# EAGLE board PlaneSimulatorIO (EAGLE 9.6.2)
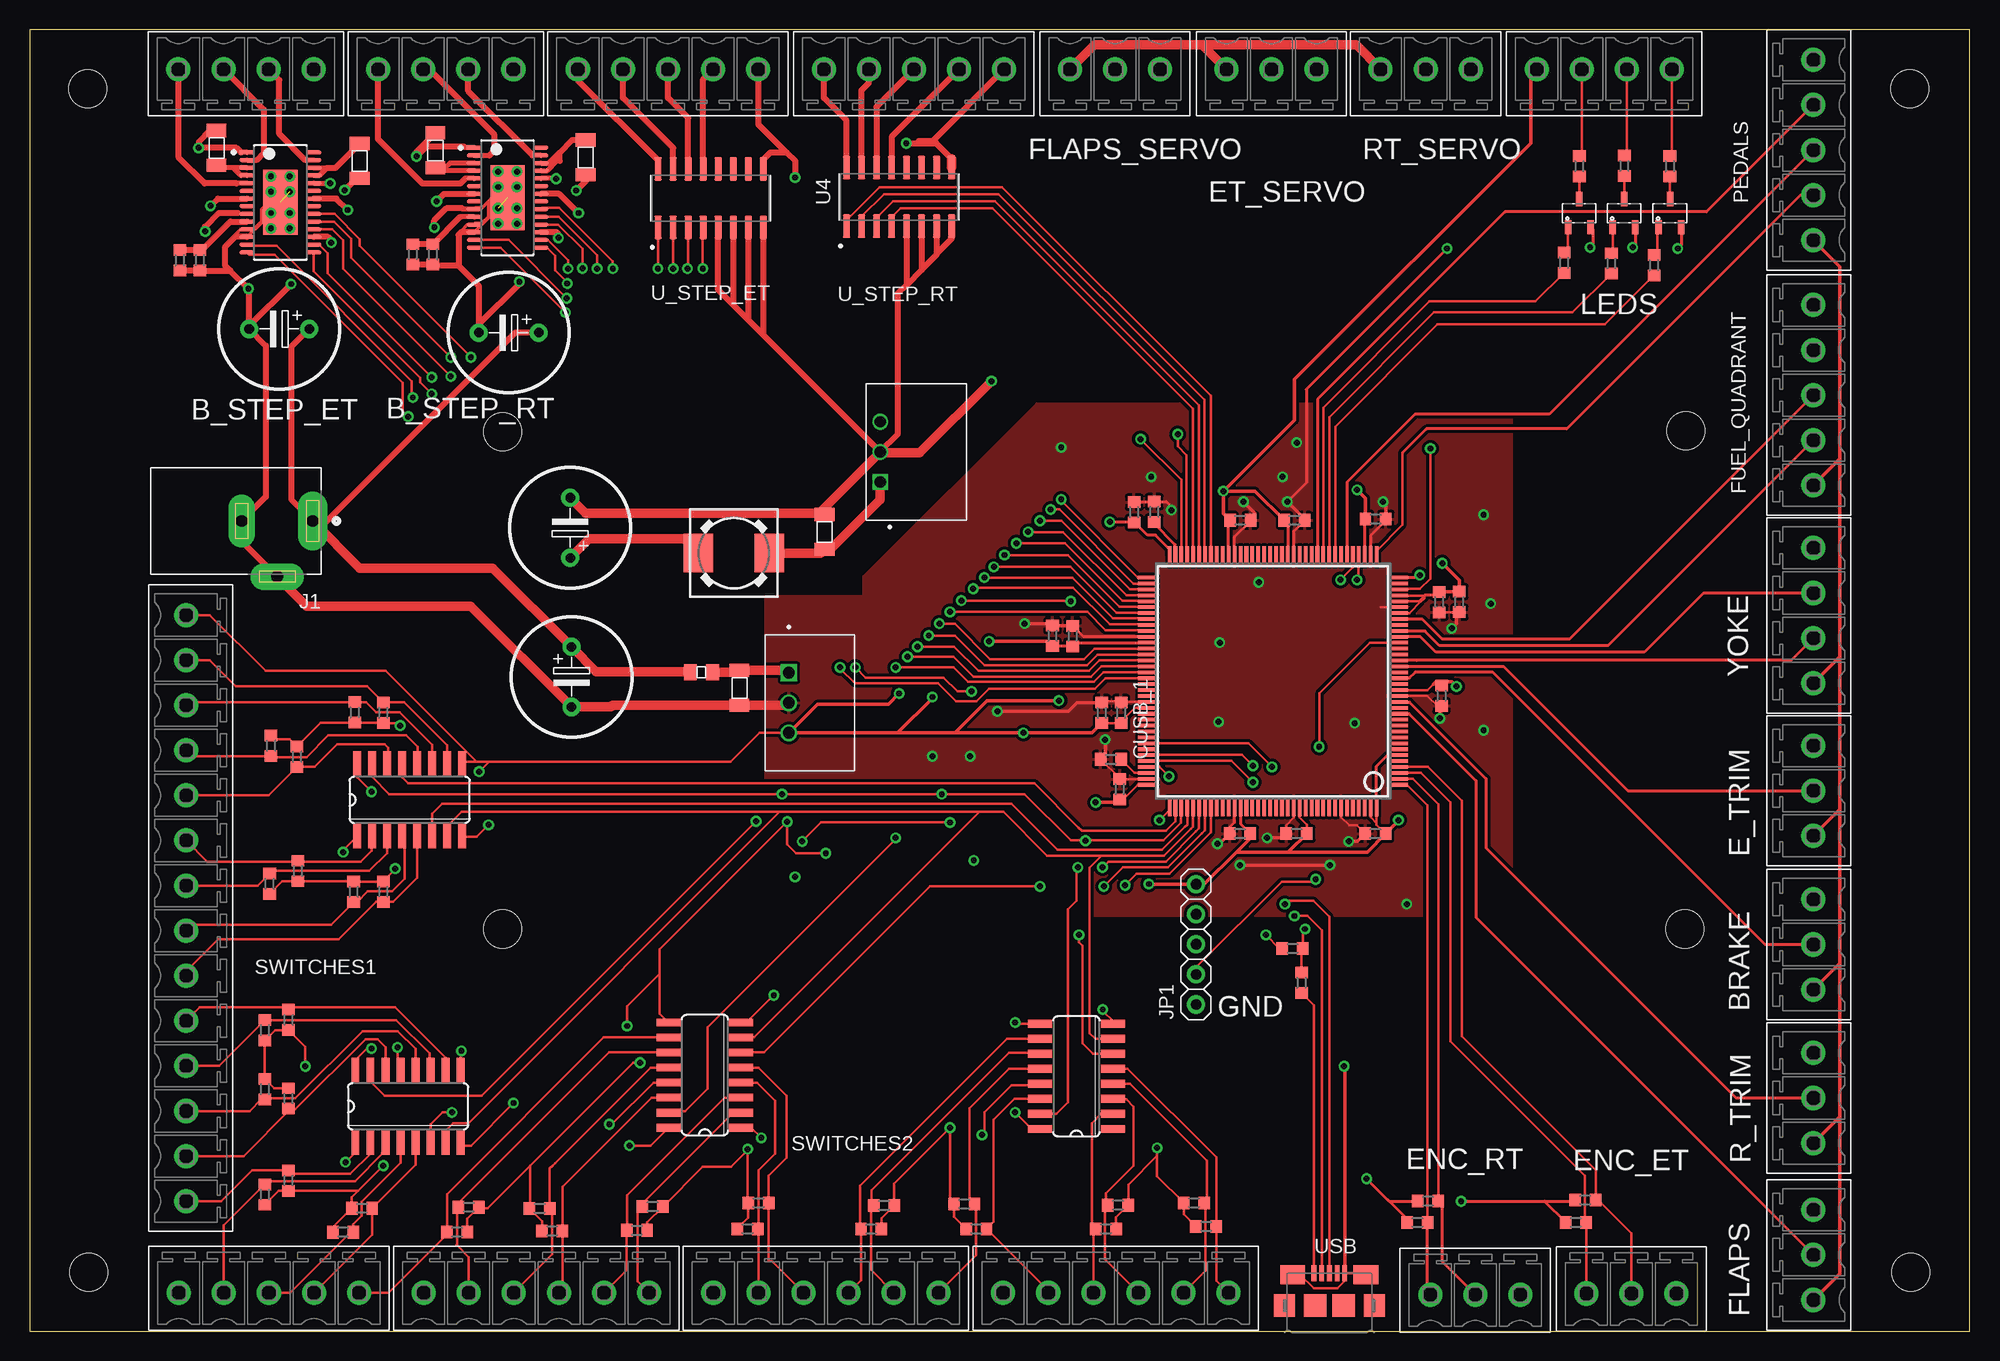
[diagram p5: board, top side]
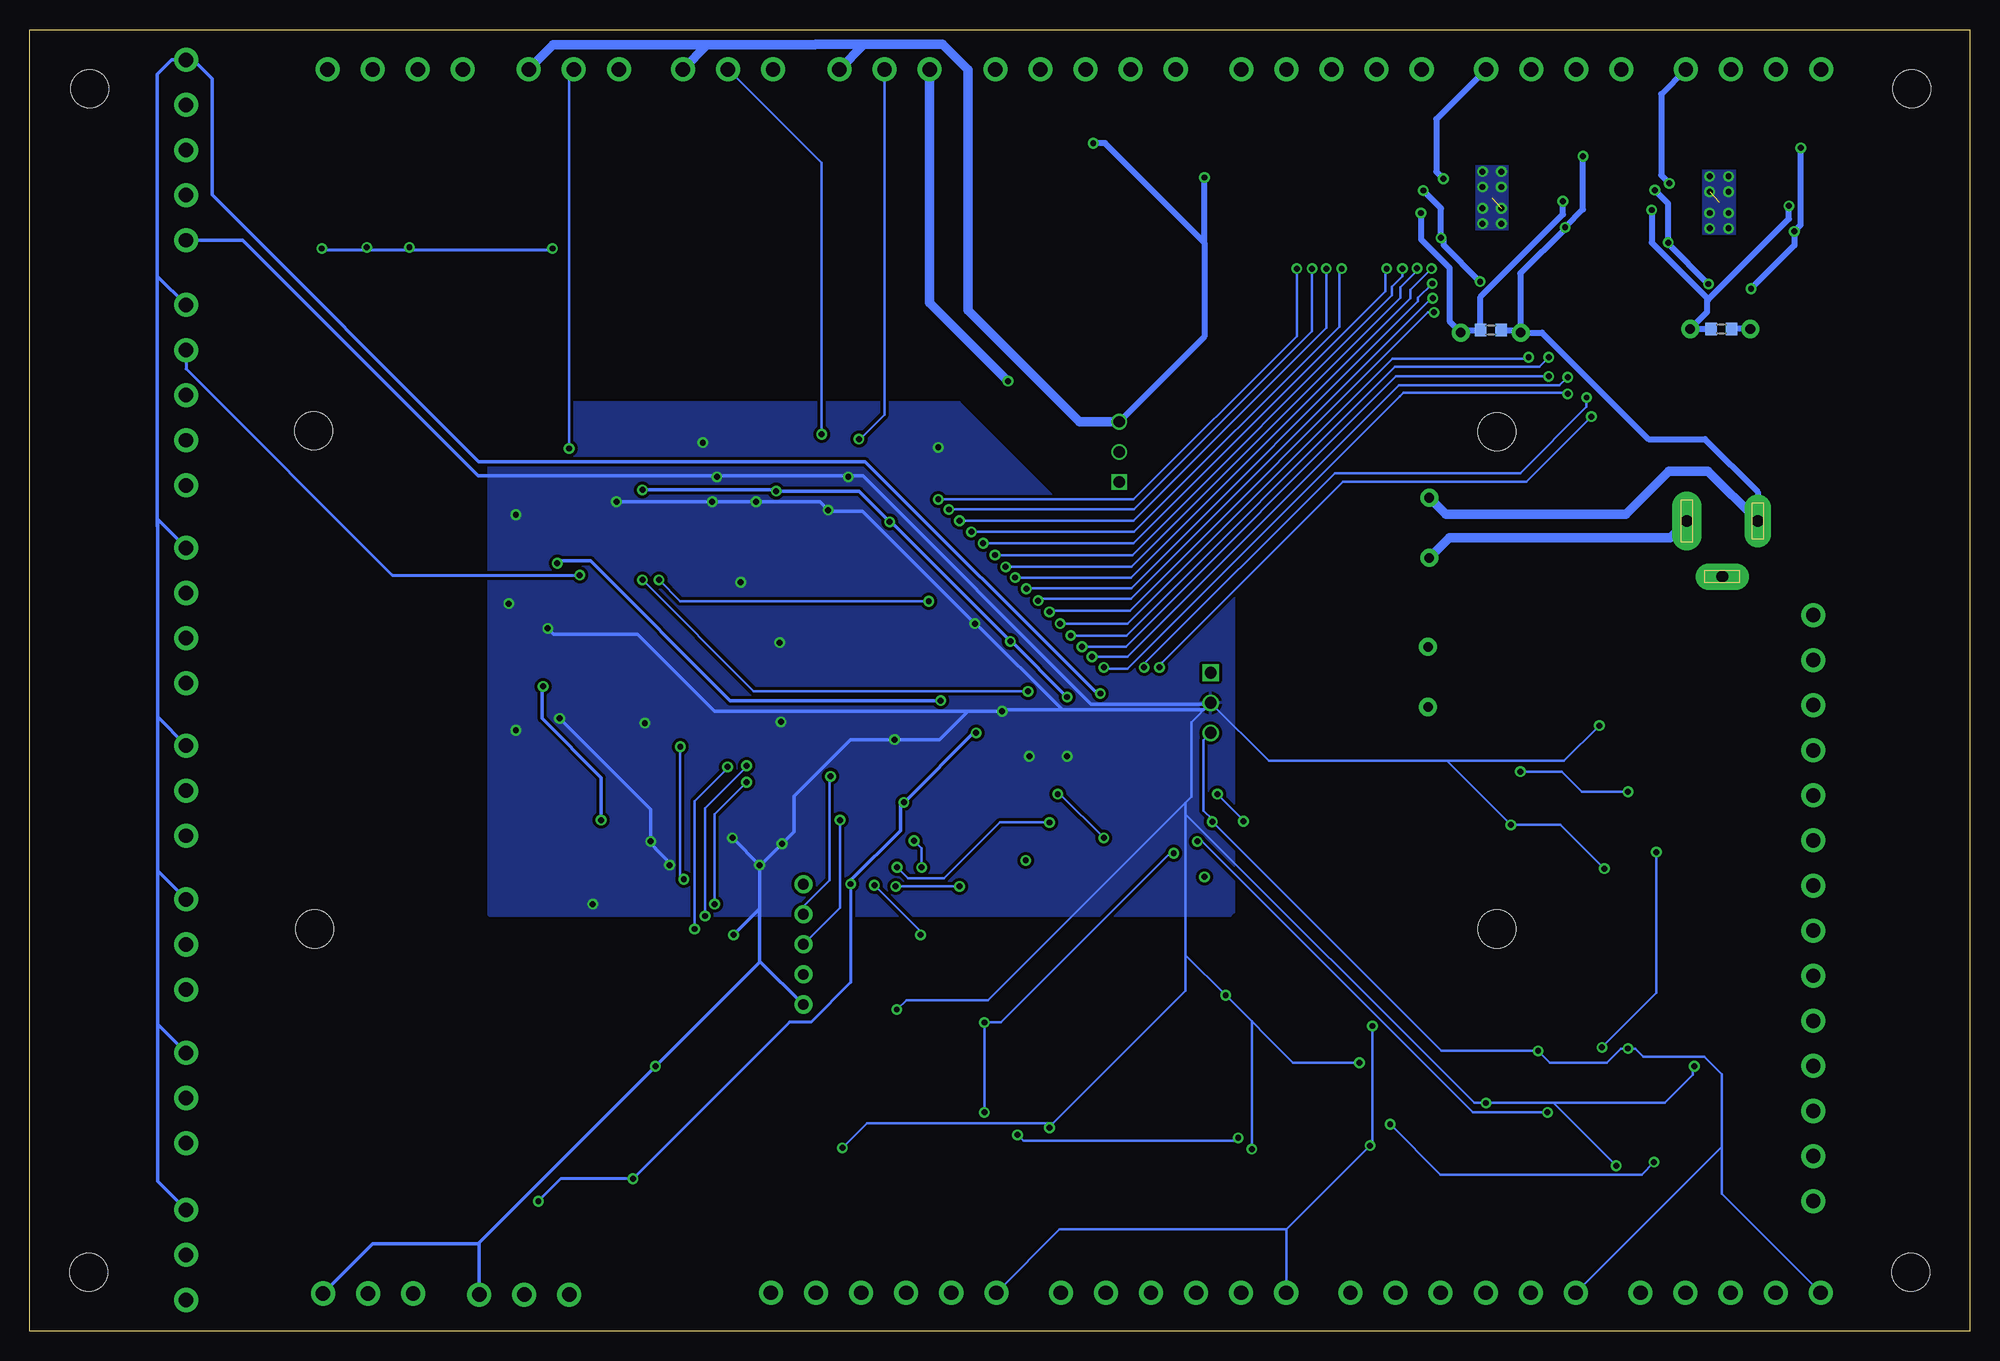
[diagram p6: board, bottom side, seen from below]

Size 164 x 110 mm. Coordinates in mm from the lower left corner, seen from the top.
Outline: 0,0 164,0 164,110 0,110 0,0
Copper layers (1*16): Top 0mil / dielectric 1.5mm / Bottom 0mil
Design rules "trida5b": minimum track width 0.1mm, minimum drill 0.5mm, track to track 0.2mm, track to pad 0.2mm, pad to pad 0.2mm, via to via 0.3mm, smd to smd 0.2mm, copper to edge 0.4mm, drill to drill 0.5mm, minimum pad ring 0.2mm, minimum via ring 0.2mm, stop-mask expansion 0mil, vias tented up to drill 0.5mm, thermal gap 10mil

## Footprints (pad centres in the part's own frame; a part is rotated, then mirrored left to right if it is on the bottom)
1206 = smd 1.118 x 1.676: 1 -1.473,0; 2 1.473,0
EC10-5 = drill 0.813 pad 1.524: 1 -2.54,0; 2 2.54,0
0805 = smd 1.067 x 1.372: 1 -0.94,0; 2 0.94,0
DR74 = smd 2.5 x 3.25: 1 -3,0; 2 3,0
0603 = smd 0.965 x 1.067: 1 -0.864,0; 2 0.864,0
MCV4 = drill 1.219 pad 2.032: 1 0,0; 2 3.81,0; 3 7.62,0; 4 11.43,0
SOT23-3L = smd 0.55 x 1.2: 1 0.95,1.2; 2 -0.95,1.2; 3 0,-1.2
MCV3 = drill 1.219 pad 2.032: 1 0,0; 2 3.81,0; 3 7.62,0
MCV5 = drill 1.219 pad 2.032: 1 0,0; 2 3.81,0; 3 7.62,0; 4 11.43,0; 5 15.24,0
SO16 = smd 0.66 x 2.032: 1 -4.445,-3.073; 2 -3.175,-3.073; 3 -1.905,-3.073; 4 -0.635,-3.073; 5 0.635,-3.073; 6 1.905,-3.073; 7 3.175,-3.073; 8 4.445,-3.073; 9 4.445,3.073; 10 3.175,3.073; 11 1.905,3.073; 12 0.635,3.073; 13 -0.635,3.073; 14 -1.905,3.073; 15 -3.175,3.073; 16 -4.445,3.073
CUI_PJ-002AH = drill 1 pad 2.5 long: 1 0,0 | drill 1 pad 2.25 long: 2 6,0; 3 3,4.7
JP_05 = drill 0.914 pad 1.524: 1 -5.08,0; 2 -2.54,0; 3 0,0; 4 2.54,0; 5 5.08,0
CONV_R-78B5.0-2.0 = drill 0.94 square: 1 -2.54,3.05 | drill 0.94: 2 0,3.05; 3 2.54,3.05
CONV_R-783.3-1.0 = drill 1 square: 1 -2.54,-1.775 | drill 1: 2 0,-1.775; 3 2.54,-1.775
MCV14 = drill 1.219 pad 2.032: 1 0,0; 2 3.81,0; 3 7.62,0; 4 11.43,0; 5 15.24,0; 6 19.05,0; 7 22.86,0; 8 26.67,0; 9 30.48,0; 10 34.29,0; 11 38.1,0; 12 41.91,0; 13 45.72,0; 14 49.53,0
ROHM_BD63715AEFV-E2_3 = smd 1.255 x 0.334: 1 -2.825,4.225; 2 -2.825,3.575; 3 -2.825,2.925; 4 -2.825,2.275; 5 -2.825,1.625; 6 -2.825,0.975; 7 -2.825,0.325; 8 -2.825,-0.325; 9 -2.825,-0.975; 10 -2.825,-1.625; 11 -2.825,-2.275; 12 -2.825,-2.925; 13 -2.825,-3.575; 14 -2.825,-4.225; 15 2.825,-4.225; 16 2.825,-3.575; 17 2.825,-2.925; 18 2.825,-2.275; 19 2.825,-1.625; 20 2.825,-0.975; 21 2.825,-0.325; 23 2.825,0.975; 24 2.825,1.625; 25 2.825,2.275; 26 2.825,2.925; 27 2.825,3.575; 28 2.825,4.225; P$22 2.825,0.325 | smd 2.9 x 5.5: 29 0,0
SOIC127P600X175-16N = smd 1.97 x 0.6: 1 -2.475,4.445; 2 -2.475,3.175; 3 -2.475,1.905; 4 -2.475,0.635; 5 -2.475,-0.635; 6 -2.475,-1.905; 7 -2.475,-3.175; 8 -2.475,-4.445; 9 2.475,-4.445; 10 2.475,-3.175; 11 2.475,-1.905; 12 2.475,-0.635; 13 2.475,0.635; 14 2.475,1.905; 15 2.475,3.175; 16 2.475,4.445
M3-HOLE = hole 3.2: 0,0
SQFP-S-20X20-144 = smd 0.3 x 1.6: 1 -8.75,-10.6; 2 -8.25,-10.6; 3 -7.75,-10.6; 4 -7.25,-10.6; 5 -6.75,-10.6; 6 -6.25,-10.6; 7 -5.75,-10.6; 8 -5.25,-10.6; 9 -4.75,-10.6; 10 -4.25,-10.6; 11 -3.75,-10.6; 12 -3.25,-10.6; 13 -2.75,-10.6; 14 -2.25,-10.6; 15 -1.75,-10.6; 16 -1.25,-10.6; 17 -0.75,-10.6; 18 -0.25,-10.6; 19 0.25,-10.6; 20 0.75,-10.6; 21 1.25,-10.6; 22 1.75,-10.6; 23 2.25,-10.6; 24 2.75,-10.6; 25 3.25,-10.6; 26 3.75,-10.6; 27 4.25,-10.6; 28 4.75,-10.6; 29 5.25,-10.6; 30 5.75,-10.6; 31 6.25,-10.6; 32 6.75,-10.6; 33 7.25,-10.6; 34 7.75,-10.6; 35 8.25,-10.6; 36 8.75,-10.6; 73 8.75,10.6; 74 8.25,10.6; 75 7.75,10.6; 76 7.25,10.6; 77 6.75,10.6; 78 6.25,10.6; 79 5.75,10.6; 80 5.25,10.6; 81 4.75,10.6; 82 4.25,10.6; 83 3.75,10.6; 84 3.25,10.6; 85 2.75,10.6; 86 2.25,10.6; 87 1.75,10.6; 88 1.25,10.6; 89 0.75,10.6; 90 0.25,10.6; 91 -0.25,10.6; 92 -0.75,10.6; 93 -1.25,10.6; 94 -1.75,10.6; 95 -2.25,10.6; 96 -2.75,10.6; 97 -3.25,10.6; 98 -3.75,10.6; 99 -4.25,10.6; 100 -4.75,10.6; 101 -5.25,10.6; 102 -5.75,10.6; 103 -6.25,10.6; 104 -6.75,10.6; 105 -7.25,10.6; 106 -7.75,10.6; 107 -8.25,10.6; 108 -8.75,10.6 | smd 1.6 x 0.3: 37 10.6,-8.75; 38 10.6,-8.25; 39 10.6,-7.75; 40 10.6,-7.25; 41 10.6,-6.75; 42 10.6,-6.25; 43 10.6,-5.75; 44 10.6,-5.25; 45 10.6,-4.75; 46 10.6,-4.25; 47 10.6,-3.75; 48 10.6,-3.25; 49 10.6,-2.75; 50 10.6,-2.25; 51 10.6,-1.75; 52 10.6,-1.25; 53 10.6,-0.75; 54 10.6,-0.25; 55 10.6,0.25; 56 10.6,0.75; 57 10.6,1.25; 58 10.6,1.75; 59 10.6,2.25; 60 10.6,2.75; 61 10.6,3.25; 62 10.6,3.75; 63 10.6,4.25; 64 10.6,4.75; 65 10.6,5.25; 66 10.6,5.75; 67 10.6,6.25; 68 10.6,6.75; 69 10.6,7.25; 70 10.6,7.75; 71 10.6,8.25; 72 10.6,8.75; 109 -10.6,8.75; 110 -10.6,8.25; 111 -10.6,7.75; 112 -10.6,7.25; 113 -10.6,6.75; 114 -10.6,6.25; 115 -10.6,5.75; 116 -10.6,5.25; 117 -10.6,4.75; 118 -10.6,4.25; 119 -10.6,3.75; 120 -10.6,3.25; 121 -10.6,2.75; 122 -10.6,2.25; 123 -10.6,1.75; 124 -10.6,1.25; 125 -10.6,0.75; 126 -10.6,0.25; 127 -10.6,-0.25; 128 -10.6,-0.75; 129 -10.6,-1.25; 130 -10.6,-1.75; 131 -10.6,-2.25; 132 -10.6,-2.75; 133 -10.6,-3.25; 134 -10.6,-3.75; 135 -10.6,-4.25; 136 -10.6,-4.75; 137 -10.6,-5.25; 138 -10.6,-5.75; 139 -10.6,-6.25; 140 -10.6,-6.75; 141 -10.6,-7.25; 142 -10.6,-7.75; 143 -10.6,-8.25; 144 -10.6,-8.75
USB-MICRO-H_10118192-0001LF = smd 0.4 x 1.35: D+ 0,0; D- -0.65,0; GND 1.3,0; ID 0.65,0; VBUS -1.3,0 | smd 2.1 x 1.6: S1 -3.1,-0.125; S2 3.1,-0.125 | smd 1.8 x 1.9: S3 -3.8,-2.7; S6 3.8,-2.7 | smd 1.9 x 1.9: S4 -1.2,-2.7; S5 1.2,-2.7
MCV6 = drill 1.219 pad 2.032: 1 0,0; 2 3.81,0; 3 7.62,0; 4 11.43,0; 5 15.24,0; 6 19.05,0

## Placement (x,y rotation side)
3.3V_C1  2.2u  [1206]  59.99,54.38 90 top
3.3V_C2  10u  [EC10-5]  45.8,55.3 270 top
3.3V_L1  5.6u  [0805]  56.79,55.7 0 top
5V_C1  4.7u  [1206]  67.19,67.56 270 top
5V_C2  10u  [EC10-5]  45.7,67.9 90 top
5V_L1  10u  [DR74]  59.52,65.76 0 top
B1_CT  820p  [0603]  12.7,90.5 90 top
B1_CVS1  100u  [EC10-5]  21.1,84.7 180 top
B1_CVS2  100n  [0603]  21,84.7 180 bottom
B1_RNF1  470m  [1206]  15.8,100 270 top
B1_RNF2  470m  [1206]  27.9,98.9 90 top
B1_RT  56k  [0603]  14.4,90.5 90 top
B2_CT  820p  [0603]  32.4,91 90 top
B2_CVS1  100u  [EC10-5]  40.5,84.4 180 top
B2_CVS2  100n  [0603]  40.5,84.6 180 bottom
B2_RNF1  470m  [1206]  34.3,99.8 270 top
B2_RNF2  470m  [1206]  47,99.2 90 top
B2_RT  56k  [0603]  34.1,91 90 top
B_STEP_ET  [MCV4]  12.58,106.64 0 top
B_STEP_RT  [MCV4]  29.46,106.64 0 top
BFS1_LED2  [SOT23-3L]  134.76,94.49 180 top
BFS2_LED3  [SOT23-3L]  138.64,94.49 180 top
BFS20_LED1  [SOT23-3L]  130.98,94.49 180 top
BRAKE  [MCV3]  150.77,36.5 270 top
C_VCAP  2.2u  [0603]  95.06,69.25 270 top
CDD_17  100n  [0603]  119.34,53.71 90 top
CDD_39  100n  [0603]  113.77,68.64 180 top
CDD_52  100n  [0603]  106.91,68.54 180 top
CDD_62  100n  [0603]  102.33,68.54 180 top
CDD_72  100n  [0603]  93.36,69.21 270 top
CDD_84  100n  [0603]  88.16,58.75 270 top
CDD_84_2  4.7u  [0603]  86.46,58.77 270 top
CDD_108  100n  [0603]  92.14,45.81 270 top
CDD_121  100n  [0603]  102.31,42.06 0 top
CDD_131  100n  [0603]  107.09,42.06 0 top
CDD_144  100n  [0603]  113.75,42.06 0 top
CG_106  2.2u  [0603]  91.39,48.34 0 top
CUSB_1  100n  [0603]  92.26,52.27 270 top
CUSB_2  1u  [0603]  90.63,52.26 270 top
CVDDA_1  1u  [0603]  119.14,61.62 90 top
CVDDA_2  10n  [0603]  120.84,61.64 90 top
E_TRIM  [MCV3]  150.77,49.5 270 top
ENC_ET  [MCV3]  139.2,3.2 180 top
ENC_RT  [MCV3]  126,3.1 180 top
ET_SERVO  [MCV3]  101.16,106.64 0 top
FLAPS  [MCV3]  150.77,10.27 270 top
FLAPS_SERVO  [MCV3]  87.93,106.64 0 top
FUEL_QUADRANT  [MCV5]  150.77,86.73 270 top
IC1  74HC166D  [SO16]  57.08,21.66 90 top
IC2  74HC166D  [SO16]  31.99,19.02 0 top
IC3  74HC166D  [SO16]  32.12,44.92 0 top
IC4  74HC166D  [SO16]  88.48,21.55 90 top
J1  PJ-002AH  [CUI_PJ-002AH]  23.93,68.48 180 top
JP1  [JP_05]  98.6,32.7 90 top
LEDS  [MCV4]  127.38,106.64 0 top
PEDALS  [MCV5]  150.77,107.44 270 top
PS1  R-78B5.0-2.0  [CONV_R-78B5.0-2.0]  74.95,74.31 90 top
PS2  R-783.3-1.0  [CONV_R-783.3-1.0]  65.95,53.11 270 top
R1  10k  [0603]  90.98,8.66 180 top
R2  10k  [0603]  92,10.66 180 top
R3  10k  [0603]  98.42,10.86 0 top
R4  10k  [0603]  99.44,8.86 0 top
R5  10k  [0603]  71.14,8.64 180 top
R6  10k  [0603]  72.22,10.64 180 top
R7  10k  [0603]  79,10.76 0 top
R8  10k  [0603]  80.02,8.66 0 top
R9  10k  [0603]  52.66,10.54 180 top
R10  10k  [0603]  51.33,8.54 180 top
R11  10k  [0603]  60.69,8.66 0 top
R12  10k  [0603]  61.61,10.86 0 top
R13  10k  [0603]  36.14,8.39 180 top
R14  10k  [0603]  37.12,10.49 180 top
R15  10k  [0603]  43.1,10.39 0 top
R16  10k  [0603]  44.18,8.49 0 top
R17  10k  [0603]  21.89,12.74 90 top
R18  10k  [0603]  19.89,11.56 90 top
R19  10k  [0603]  26.49,8.38 0 top
R20  10k  [0603]  28.09,10.4 0 top
R21  10k  [0603]  21.89,26.32 90 top
R22  10k  [0603]  19.89,25.44 90 top
R23  10k  [0603]  19.89,20.46 270 top
R24  10k  [0603]  21.89,19.68 270 top
R25  10k  [0603]  22.69,38.9 90 top
R26  10k  [0603]  20.29,37.82 90 top
R27  10k  [0603]  27.39,37.14 270 top
R28  10k  [0603]  29.89,37.16 270 top
R29  10k  [0603]  29.89,52.28 90 top
R30  10k  [0603]  27.49,52.3 90 top
R31  10k  [0603]  20.41,49.48 270 top
R32  10k  [0603]  22.61,48.56 270 top
R33  10k  [0603]  131.5,11.1 180 top
R34  10k  [0603]  130.7,9.2 180 top
R35  10k  [0603]  118.2,11 180 top
R36  10k  [0603]  117.3,9.2 180 top
R_TRIM  [MCV3]  150.77,23.53 270 top
RLED1_1  50  [0603]  130.99,98.46 90 top
RLED1_2  1300  [0603]  129.69,90.29 90 top
RLED2_1  50  [0603]  134.79,98.48 90 top
RLED2_2  1300  [0603]  133.69,90.24 90 top
RLED3_1  50  [0603]  138.64,98.46 90 top
RLED3_2  1300  [0603]  137.29,90.09 90 top
RT_SERVO  [MCV3]  114.19,106.64 0 top
RVBUS_1  4700  [0603]  107.51,29.46 270 top
RVBUS_2  10000  [0603]  106.75,32.35 0 top
SWITCHES1  [MCV14]  13.24,11 90 top
SWITCHES2  [MCV5]  27.85,3.26 180 top
U1  ROHM_BD63715AEFV-E2ROHM_BD63715AEFV-E2_0_3  [ROHM_BD63715AEFV-E2_3]  21.2,95.4 0 top
U2  ROHM_BD63715AEFV-E2ROHM_BD63715AEFV-E2_0_3  [ROHM_BD63715AEFV-E2_3]  40.4,95.8 0 top
U3  ULN2003ADR  [SOIC127P600X175-16N]  57.57,95.76 90 top
U4  ULN2003ADR  [SOIC127P600X175-16N]  73.49,95.86 90 top
U$1  [M3-HOLE]  40,76 0 top
U$2  [M3-HOLE]  4.9,105 0 top
U$3  [M3-HOLE]  158.9,105 0 top
U$4  [M3-HOLE]  159,5 0 top
U$5  [M3-HOLE]  5,5 0 top
U$43  [M3-HOLE]  139.9,34 0 top
U$44  [M3-HOLE]  140,76.1 0 top
U$45  [SQFP-S-20X20-144]  105.1,54.94 90 top
U$62  [M3-HOLE]  40,34 0 top
U_STEP_ET  [MCV5]  46.34,106.64 0 top
U_STEP_RT  [MCV5]  67.13,106.64 0 top
USB  [USB-MICRO-H_10118192-0001LF]  109.86,4.9 0 top
XC3  [MCV6]  101.34,3.26 180 top
XC4  [MCV6]  76.84,3.26 180 top
XC6  [MCV6]  52.36,3.26 180 top
YOKE  [MCV4]  150.77,66.2 270 top

## Tracks (layer width: path | path; a pad name or v marks a point on that pad's centre or on a via)
12V_3V_VIN
  Top 0.813: 3.3V_L1.2 59.84,55.7 3.3V_C1.2 63.97,55.85 PS2.1
12V_5V_VIN
  Top 0.813: 5V_L1.2 66.86,65.76 5V_C1.2 67.72,66.09 71.9,70.27 PS1.1
+3V3  (via drill 0.5)
  Top 0.152: CDD_108.2 92.45,44.95 | 93.69,46.19 U$45.108 | 117.9,62.18 117.88,62.16
  Top 0.2: SWITCHES1.14 15.24,60.53 19.94,55.83 30.09,55.83 37.78,48.15 | 37.78,48.15 36.72,48.15 IC3.9 | 37.78,48.15 38.85,48.15 | 38.85,48.15 59.26,48.15 61.69,50.57 PS2.3 | IC3.16 27.68,46.83 v28.9,45.6 | v38,47.3 38.85,48.15 | IC2.9 36.44,23.7 v36.5,23.7 | IC2.16 27.55,22.95 28.5,23.9 v28.9,23.9 | 53.23,30.2 53.23,32.27 v64.03,43.07 64.03,41.17 64.8,40.4 v67.3,40.4 | IC1.9 53.96,26.11 53.23,26.83 53.23,30.2 | v50.5,25.8 50.5,27.47 53.23,30.2 | v50.7,15.7 52.49,15.7 IC1.16 | v83.3,26.1 83.41,26 IC4.9 | v83.3,18.5 84.69,17.11 IC4.16 | 92.45,44.95 93.69,46.19 | CUSB_2.2 CUSB_1.2 92.26,51.51 93.44,52.69 U$45.95 | 117.88,62.16 115.73,62.16 U$45.33 | CDD_17.2 119.25,54.67 118.63,54.67 118.16,54.19 U$45.17 | CDD_144.2 113.85,42.82 113.85,42.92 | 113.85,42.92 U$45.144 | U$45.143 113.35,43.42 113.85,42.92 | U$45.131 107.32,44.31 107.32,43.43 107.95,42.8 CDD_131.2
  Top 0.203: 117.61,61.69 117.41,61.69 | 117.41,61.69 U$45.32 | U$45.30 116.61,60.69 117.61,61.69 | 117.41,61.69 117.88,62.16 117.88,61.96 117.61,61.69
  Top 0.254: U$45.72 96.35,66.1 95.17,67.28 94.49,67.28 93.36,68.41 | 93.36,68.41 CDD_72.2 | v91.3,68.4 v91.31,68.41 93.36,68.41 | U$45.62 101.35,68.42 CDD_62.2 | U$45.52 106.35,68.24 CDD_52.2 | U$45.39 112.85,68.58 CDD_39.2 | U$45.6 115.68,48.67 114.77,48.67 113.85,47.75 U$45.144 | U$45.84 88.46,58.19 CDD_84.2 88.14,57.91 CDD_84_2.2 | R36.2 116.44,9.46 v113,12.9 114.9,11 R35.2 | v121,11 128.04,11 | 128.04,11 130.54,11 R33.2 | 128.04,11 R34.2 | U$45.121 102.35,42.88 CDD_121.2 | CVDDA_1.2 118.84,62.18 117.9,62.18
  Top 0.305: CUSB_2.2 89.8,50.57 v84,50.57 78.2,50.57 | v100.9,71 100.9,69.11 CDD_62.2 | v112.2,71.1 112.91,70.39 CDD_39.2 | v119.4,64.9 120.84,63.46 CVDDA_2.2 120.82,62.48 CVDDA_1.2 | v120.6,54.5 120.2,54.9 118.87,54.9 118.63,54.67 | 73.37,50.57 PS2.3 66.6,53 72.6,53 v73.5,53.9 | v76.3,53.6 76.3,53.5 73.37,50.57 | v81.1,58.3 86.07,58.3 CDD_84_2.2 | v100.9,71 103.59,71 CDD_52.2 | v87,53.3 80.93,53.3 78.2,50.57 | CDD_108.2 91.89,44.7 v90.1,44.7 | v94.6,37.8 94.62,37.78 JP1.5 99.28,37.78 102,40.5 | v115.7,43.2 115.7,43.15 CDD_144.2 113.06,40.5 107,40.5 | CDD_121.2 103.17,41.67 102,40.5 | 102,40.5 106.99,40.5 107,40.5 | CDD_131.2 106.49,40.6 106.59,40.5 107,40.5 | v100.9,71 106.9,77 106.9,80.44 126.88,100.42 126.88,106.14 LEDS.1 | 73.37,50.57 78.2,50.57
  Bottom 0.2: v28.9,45.6 32.8,45.6 34.5,47.3 v38,47.3 | 20.98,15.6 20.98,21.73 22.45,23.2 27.6,23.2 28.3,23.9 v28.9,23.9 29.5,23.9 30.7,22.7 35.5,22.7 v36.5,23.7 44.66,23.7 v64.03,43.07 64.03,43.27 64.78,44.01 64.78,49.97 PS2.3 | XC6.6 20.98,15.6 | 20.98,15.6 20.98,11.62 SWITCHES2.5 | v50.5,25.8 50.5,15.9 v50.7,15.7 57.79,8.61 | XC4.6 57.79,8.61 | 57.79,8.61 76.94,8.61 XC3.6 | v67.3,40.4 67.6,40.4 81.9,26.1 v83.3,26.1 v83.3,18.5
  Bottom 0.254: v91.3,68.4 91.2,68.4 | v94.6,37.8 94.6,29.48 97.95,26.13 99.77,26.13 v113,12.9 119.1,12.9 v121,11
  Bottom 0.305: 153.2,89.16 FUEL_QUADRANT.1 | 153.2,89.16 153.2,106.21 151.97,107.44 PEDALS.1 150.17,107.44 148.57,105.84 148.57,96.04 126.03,73.5 93.4,73.5 73.8,53.9 v73.5,53.9 | 153.2,89.16 153.2,68.03 153.19,68.02 | YOKE.1 153.19,68.61 153.19,68.02 | 153.19,68.02 153.19,51.91 | 153.19,51.91 E_TRIM.1 | 153.19,51.91 153.19,38.91 | 153.19,38.91 BRAKE.1 | 153.19,38.91 153.19,25.95 | R_TRIM.1 153.19,25.95 | 153.19,25.95 153.19,12.69 FLAPS.1 | v76.3,53.6 81.05,58.35 v81.1,58.3 91.2,68.4 | v91.3,68.4 93.9,71 v100.9,71 101,71.1 v112.2,71.1 | v119.4,64.9 119.2,65.1 116.6,65.1 104.8,53.3 v87,53.3 | v94.6,37.8 94.6,38.1 90.4,42.3 90.4,44.4 v90.1,44.7 89.93,44.87 89.9,44.87 84.2,50.57 v84,50.57 | v115.7,43.2 115.7,46.8 120.7,51.8 120.7,54.4 v120.6,54.5 | v84,50.57
+5V  (via drill 0.5)
  Top 0.508: v64.7,97.5 64.7,98.9 64,99.6 | U_STEP_ET.5 61.58,102.02 64,99.6 | 64,99.6 62.6,99.6 62,99 62,98.25 U3.9 | 77.94,99.1 76.63,100.4 v74.1,100.4 75,100.4 75.17,100.57 76.3,100.57 U_STEP_RT.5
  Top 0.813: 77.94,99.1 U4.9
  Bottom 0.508: PS1.3 64.7,84.05 64.7,92 | 64.7,92 v64.7,97.5 | 64.7,92 73.1,100.4 v74.1,100.4
  Bottom 0.813: 93.45,108.74 FLAPS_SERVO.3 | PS1.3 75.26,76.85 84.7,86.29 84.7,106.6 86.84,108.74 93.45,108.74 | ET_SERVO.3 106.72,108.7 | 106.72,108.7 97.61,108.7 97.57,108.74 93.45,108.74 | 106.72,108.7 119.75,108.7 RT_SERVO.3
+12V  (via drill 0.5)
  Top 0.508: v15.3,95.1 15.93,95.72 U1.7 | v26.9,94.76 25.93,95.72 U1.P$22 | v46.4,94.5 44.77,96.12 U2.P$22 | v34.4,95.5 35.02,96.12 U2.7 | B1_CVS1.1 22.13,83.19 22.13,70.28 J1.1 24.03,68.38 25.02,68.38 41.04,84.4 B2_CVS1.1
  Top 0.813: 5V_C2.1 47.3,66.96 55.32,66.96 5V_L1.1 | J1.1 27.91,64.5 39.14,64.5 3.3V_C2.1 47.9,55.74 55.81,55.74 3.3V_L1.1
  Bottom 0.508: v15.3,95.1 15.3,94 22.1,87.2 22.2,87.3 | 22.2,87.3 26.9,92 v26.9,94.76 | B1_CVS2.2 B1_CVS1.1 22.2,86.14 22.2,87.3 | v46.4,94.5 46.4,92.28 44,89.87 44,85.36 B2_CVS1.1 42.84,84.6 B2_CVS2.2 41.36,87.42 34.4,94.38 v34.4,95.5
  Bottom 0.813: 5V_C2.1 43.98,67.08 25.33,67.08 J1.1
A_BRAKE
  Top 0.254: U$45.19 115.72,55.21 116.64,55.21 117.12,55.7 123.66,55.7 146.67,32.69 BRAKE.2
A_ETRIM
  Top 0.254: U$45.21 124.57,56.19 135.07,45.69 E_TRIM.2
A_FLAPS
  Top 0.254: U$45.13 116.6,52.19 122.24,46.55 122.24,34.99 FLAPS.2
A_LBRAKE
  Top 0.254: PEDALS.3 128.45,77.5 117.1,77.5 111.35,71.75 U$45.42
A_MIX
  Top 0.254: FUEL_QUADRANT.3 130.16,58.5 119.4,58.5 117.73,60.17 115.72,60.17 U$45.29
A_PITCH
  Top 0.254: U$45.26 117.57,58.69 118.87,57.39 136.47,57.39 141.47,62.39 YOKE.2
A_PROP
  Top 0.254: FUEL_QUADRANT.4 133.41,57.94 119.16,57.94 117.94,59.17 115.72,59.17 U$45.27
A_RBRAKE
  Top 0.2: 116.05,74.24 116.05,68.14 113.85,65.94 U$45.37
  Top 0.254: 116.05,74.24 118.06,76.25 129.92,76.25 149.67,96.01 PEDALS.4
A_ROLL
  Top 0.254: YOKE.3 148.89,56.7 117.22,56.7 117.23,56.71 115.77,56.71 115.72,56.67 U$45.22
A_RTRIM
  Top 0.254: U$45.15 115.72,53.17 116.64,53.17 123.1,46.7 123.1,40.85 144.23,19.72 R_TRIM.2
A_RUDDER
  Top 0.2: 108.86,66.14 108.9,66.1 108.9,65.59 U$45.47
  Top 0.254: PEDALS.2 141.74,94.6 124.7,94.6 108.86,78.76 108.86,66.14
A_THR  (via drill 0.5)
  Top 0.254: v117.5,63.9 117.29,63.69 U$45.36
  Bottom 0.254: FUEL_QUADRANT.2 150.77,81.32 133.35,63.9 v117.5,63.9
B1_DIR  (via drill 0.5)
  Top 0.2: U$45.88 90.6,56.19 89.72,55.3 79.8,55.3 78.1,57 v74.2,57 | v34,80.63 25.2,89.43 25.2,91.12 24.5,91.83 U1.16
  Bottom 0.2: v34,80.63 34.7,79.93 48.27,79.93 71.2,57 v74.2,57
B1_EN  (via drill 0.5)
  Top 0.2: v37.3,82.32 27.9,91.72 27.9,92.3 25.77,94.42 U1.20 | U$45.85 90,57.69 89.12,56.8 81.2,56.8 78.2,59.8 v76.9,59.8
  Bottom 0.2: v37.3,82.32 37.45,82.17 48.83,82.17 71.2,59.8 v76.9,59.8
B1_MODE0  (via drill 0.5)
  Top 0.2: v35.6,80.7 26.5,89.8 26.5,92.2 25.57,93.12 U1.18 | U$45.87 90.44,56.69 89.55,55.8 80.2,55.8 78.15,57.85 v75.05,57.85
  Bottom 0.2: v35.6,80.7 48.5,80.7 71.35,57.85 v75.05,57.85
B1_MODE1  (via drill 0.5)
  Top 0.2: U1.19 25.76,93.78 27.2,92.33 27.2,90.71 v35.6,82.31 | U$45.86 90.27,57.19 89.38,56.3 80.7,56.3 78.2,58.8 v76,58.8
  Bottom 0.2: v35.6,82.31 36.4,81.51 48.59,81.51 71.3,58.8 v76,58.8
B1_OUT1A
  Top 0.406: U1.5 17.52,97.03 17.5,97
  Top 0.508: B_STEP_ET.1 12.58,99.22 14.8,97 17.5,97
B1_OUT1B
  Top 0.406: U1.2 19.19,98.97
  Top 0.508: B_STEP_ET.2 19.8,103.23 19.8,99.58 19.19,98.97
B1_OUT2A  (via drill 0.5)
  Top 0.406: U1.24 25.38,97.03 v25.4,97
  Bottom 0.508: v25.4,97 26.1,97.7 26.1,104.55 B_STEP_ET.4
B1_OUT2B
  Top 0.406: U1.27 23.3,98.97
  Top 0.508: 23.3,98.97 21.1,101.18 21.1,105.74 B_STEP_ET.3
B1_RESET  (via drill 0.5)
  Top 0.2: U1.14 18.57,90.97 20.73,90.97 31.55,80.15 31.55,77.75 v32,77.3 | U$45.90 90.93,55.19 90.05,54.3 81.1,54.3 80.03,53.23 78.31,53.23 76.79,54.75 69.75,54.75 68.5,56 v68.5,56.1
  Bottom 0.2: v68.5,56.1 68.3,56.3 68.3,56.5 53,71.8 37.5,71.8 v32,77.3
B1_STEP  (via drill 0.5)
  Top 0.2: U$45.89 90.77,55.69 89.98,54.9 79.3,54.9 78.1,56.1 v73.2,56.1 | U1.15 24.02,89.58 33,80.6 33,80.22 v34,79.22
  Bottom 0.2: v73.2,56.1 73.1,56 71.2,56 48.18,79.02 47.9,79.3 34.08,79.3 v34,79.22
B1_VREF  (via drill 0.5)
  Top 0.2: U1.13 18.48,91.72 20.88,91.72 32.3,80.3 32.3,79.01 v32.4,78.91 | v79.62,54.08 78.42,54.08 77.25,55.25 70.65,55.25 v69.8,56.1 | v112.2,63.5 112.3,63.6 112.3,65.49 U$45.40
  Bottom 0.2: v32.4,78.91 32.4,78.11 38,72.51 53.69,72.51 69.8,56.4 v69.8,56.1 | v79.62,54.08 79.78,54.08 79.8,54.1 102.8,54.1 v112.2,63.5
B2_DIR  (via drill 0.5)
  Top 0.152: U2.16 43.77,92.22
  Top 0.2: v45.5,89.8 45.5,90.5 43.77,92.22 | v80.7,63.7 88.13,63.7 91.59,60.24 94.45,60.24 U$45.80
  Bottom 0.2: v45.5,89.8 47.3,88 47.3,87.3 70.9,63.7 v80.7,63.7
B2_EN  (via drill 0.5)
  Top 0.2: U2.20 43.33,94.92 44.77,94.92 49.3,90.4 v49.3,89.8 | v83.4,66.6 87.52,66.6 92.38,61.74 94.45,61.74 U$45.77
  Bottom 0.2: v49.3,89.8 49.4,89.7 49.4,87.9 70.7,66.6 v83.4,66.6
B2_MODE0  (via drill 0.5)
  Top 0.2: U2.18 44.67,93.53 46.73,91.47 v46.73,89.83 | v81.5,64.6 87.99,64.6 91.85,60.74 94.45,60.74 U$45.79
  Bottom 0.2: v46.73,89.83 46.73,89.64 48.13,88.23 48.13,87.33 70.87,64.6 v81.5,64.6
B2_MODE1  (via drill 0.5)
  Top 0.2: U2.19 44.73,94.17 47.97,90.93 v47.97,89.8 | v82.4,65.6 87.76,65.6 92.12,61.24 94.45,61.24 U$45.78
  Bottom 0.2: v47.97,89.8 47.97,89.15 48.84,88.27 48.84,87.56 70.8,65.6 v82.4,65.6
B2_OUT1A
  Top 0.406: U2.5 36.85,97.42
  Top 0.508: B_STEP_RT.1 29.46,100.74 33.2,97 36.43,97 36.85,97.42
B2_OUT1B
  Top 0.406: U2.2 38.88,99.38
  Top 0.508: B_STEP_RT.2 33.77,106.64 39.3,101.11 39.3,99.8 38.88,99.38
B2_OUT2A  (via drill 0.5)
  Top 0.406: U2.24 44.48,97.42 v44.5,97.4
  Bottom 0.508: v44.5,97.4 45.1,98 45.1,102.43 B_STEP_RT.4
B2_OUT2B
  Top 0.406: U2.27 42.5,99.38
  Top 0.508: B_STEP_RT.3 37.08,104.8 42.5,99.38
B2_RESET  (via drill 0.5)
  Top 0.2: v45.29,86.1 45.27,86.1 39.8,91.58 U2.14 | v77.8,60.8 89.4,60.8 90.96,59.24 94.45,59.24 U$45.82
  Bottom 0.2: v45.29,86.1 45.8,86.1 71,60.9 77.7,60.9 v77.8,60.8
B2_STEP  (via drill 0.5)
  Top 0.2: v45.44,88.54 45.44,88.66 44.42,89.67 44.42,90.88 43.73,91.58 U2.15 | v79.75,62.75 79.85,62.85 88.21,62.85 91.32,59.74 94.45,59.74 U$45.81
  Bottom 0.2: v45.44,88.54 46.64,87.34 46.64,87.04 70.88,62.8 79.7,62.8 v79.75,62.75
B2_VREF  (via drill 0.5)
  Top 0.2: U2.13 40.48,92.22 v45.4,87.3 | v88,61.7 87.95,61.75 v78.75,61.75 | v110.8,63.5 111.85,64.55 U$45.41
  Bottom 0.2: v45.4,87.3 45.5,87.3 70.9,61.9 78.61,61.9 v78.75,61.75 | v88,61.7 109,61.7 v110.8,63.5
DM  (via drill 0.5)
  Top 0.2: USB.D- 109.21,33.89 108,35.1 v106.9,35.1 | v103.4,47.8 102.46,48.74 94.55,48.74 U$45.103
  Bottom 0.2: v106.9,35.1 106.9,44.2 103.4,47.7 v103.4,47.8
DP  (via drill 0.5)
  Top 0.2: USB.D+ 109.86,35.04 108.5,36.4 106.4,36.4 v106.1,36.1 | v103.4,46.4 101.6,48.2 U$45.104
  Bottom 0.2: v106.1,36.1 106.1,43.7 v103.4,46.4
GND  (via drill 0.5)  (2 unrouted)
  Top 0.152: 94.48,46.67 U$45.107 | 92.14,46.73 CDD_108.1 | 120.62,60.56 CVDDA_2.1
  Top 0.2: IC3.8 36.5,41.78 37.78,41.78 v38.8,42.8 | v31.32,51.18 31.12,51.38 29.92,51.38 R29.1 29.87,51.44 R30.1 24.62,51.44 R32.1 21.99,50.04 20.71,50.04 R31.1 | v30.9,39.1 30.9,39.03 R28.1 29.87,38 R27.1 27.36,38.04 R25.1 21.37,38.04 R26.1 | v23.3,22.4 23.3,24.05 R21.1 20.77,25.46 R22.1 R23.1 20.67,20.54 R24.1 | R19.1 25.63,8.8 R20.1 27.23,11.33 v29.9,14 27.78,11.88 R17.1 21.07,11.88 R18.1 | IC2.8 36.44,15.7 37.3,15.7 v40.9,19.3 | v62.9,28.4 60.6,26.11 IC1.8 | R11.1 60.75,9.58 R12.1 60.7,10.91 v60.7,15.4 60.7,15.3 59.3,13.9 56.88,13.9 R9.1 52.19,9.21 R10.1 | R15.1 42.31,10.31 | 42.31,10.31 43.32,9.31 R16.1 | R13.1 37,9.51 37.9,10.4 | 37.9,10.4 R14.1 | 42.31,14.01 42.31,10.31 | v51.6,22.7 51,22.7 42.31,14.01 | 42.31,14.01 38.7,10.4 37.9,10.4 | R5.1 72,9.56 R6.1 73.08,12.48 v77.8,17.2 77.8,11.1 R7.1 78.14,9.68 R8.1 | R4.1 97.56,9.88 R3.1 95.3,13.12 v95.3,15.5 95.3,14.83 92.86,12.4 R2.1 91.84,9.64 R1.1 | IC4.8 91.65,26.09 91.65,26.15 90.7,27.1 v90.7,27.2 | CDD_108.1 94.48,46.67 | CG_106.1 92.14,46.73 | CUSB_2.1 90.63,53.22 92.17,53.22 CUSB_1.1 92.32,53.19 U$45.94 | 103.58,68.16 103.22,68.52 CDD_62.1 | CVDDA_1.1 120.6,60.76 | 120.6,60.56 120.62,60.56 | U$45.16 115.73,53.72 118.11,53.72 118.98,52.85 CDD_17.1 | U$45.138 110.85,43.45 111.54,42.76 112.19,42.76 CDD_144.1 | U$45.130 106.88,44.31 106.88,43.43 106.23,42.78 CDD_131.1 | 111.16,22.34 v111.1,22.4 | RVBUS_2.1 105.65,32.35 v104.5,33.5 | USB.S2 112.83,4.9 USB.GND 111.21,4.85 111.21,4.3 110.53,3.62 108.54,3.62 107.39,4.78 USB.S1
  Top 0.203: U$45.31 114.71,61.19 114.7,61.2 114.2,61.2 114.21,61.19 U$45.31
  Top 0.254: U$45.83 89.08,58.69 CDD_84.1 | v96.5,69.4 96.5,69.7 96.09,70.11 C_VCAP.1 95.02,70.07 CDD_72.1 | U$45.61 101.85,67.15 103.22,68.52 | U$45.51 106.85,67.62 CDD_52.1 | U$45.38 113.35,67.26 114.63,68.54 CDD_39.1 | v106.3,70.1 107.9,71.7 107.9,79.6 v119.8,91.5 | v131.9,91.6 132.13,91.83 132.13,93.09 BFS20_LED1.2 | BFS1_LED2.2 135.71,91.81 v135.5,91.6 | BFS2_LED3.2 139.59,91.79 v139.3,91.5 | U$45.120 101.83,44.32 101.83,43.01 101.35,42.52 101.35,42.16 CDD_121.1
  Top 0.305: CUSB_2.1 88.52,53.12 87.8,52.4 v81.8,52.4 | v90.9,50 90.93,50 90.93,48.74 CG_106.1 | CDD_121.1 100.59,41.2 v100.4,41.2 | CDD_17.1 119.2,52.71 v119.2,51.8 | USB.GND 111.16,22.34 | 120.6,60.76 120.6,60.56 120.6,59.8 v120.2,59.4 | PEDALS.5 153,89.97 153,73.72 | 153,73.72 FUEL_QUADRANT.5 | 153,73.72 153,57 | 153,57 YOKE.4 | 153,57 153,44.11 | 153,44.11 E_TRIM.3 | 153,44.11 153,31.11 | 153,31.11 BRAKE.3 | 153,31.11 153,18.14 | 153,18.14 R_TRIM.3 | 153,18.14 153,4.88 FLAPS.3 | v102.6,70.1 103.58,69.12 103.58,68.16 | CDD_52.1 107.77,68.63 v106.3,70.1 | v114.4,70.1 114.63,69.87 CDD_39.1 | v84.1,59.8 86.29,59.8 CDD_84_2.1 88.14,59.63 CDD_84.1 | v109.9,39.4 v102.3,39.4 | v111.5,41.41 112.23,41.41 CDD_144.1 | v104.6,41.7 105.9,41.7 106.23,42.03 CDD_131.1 | U1.9 17.68,94.42 17.6,94.51 | 17.38,92.47 17.38,92.67 17.82,93.12 U1.11 18.42,93.17 18.96,93.17 19.6,93.8 | 36.5,92.9 36.5,93 37,93.5 37.55,93.5 U2.11 37.67,93.62 38.21,93.62 38.8,94.2 | U2.9 37.71,94.96 38.25,94.96 39.09,95.8 39.36,95.8 | 38.8,94.2 38.8,95.23 39.27,95.7 | 39.27,95.7 39.36,95.8 | 39.36,95.8 U2.29 40.3,95.7 39.27,95.7 | U2.12 38.8,94.1 38.8,94.2 | 19.6,93.8 19.6,94.83 20.07,95.3 | 20.07,95.3 20.16,95.4 20.8,95.4 | 20.8,95.4 U1.29 | U1.12 19.6,93.7 19.6,93.8 | 20.07,95.3 20.7,95.3 20.8,95.4
  Top 0.406: U2.9 36.67,94.83 36.6,94.9 | B1_RNF1.1 15.27,101.47 | U1.1 17.88,99.62 | U2.1 36.77,100.03 36.7,100.1
  Top 0.508: J1.3 17.93,66.78 J1.2 19.96,70.51 19.96,83.3 B1_CVS1.2 | B1_CT.1 B1_RT.1 16.96,89.64 | v14.84,92.95 14.84,93.35 16,94.51 17.6,94.51 | v25.5,92 25.5,92.2 25.23,92.47 U1.17 | 36.25,90.05 36.25,92.65 36.5,92.9 37.55,92.9 U2.12 | U1.12 17.38,92.47 16.5,91.6 16.5,90.1 16.96,89.64 | v26.63,96.43 27.63,97.43 B1_RNF2.1 | 36.25,90.05 34.19,90.05 B2_RT.1 B2_CT.1 | v34.21,93.29 34.21,93.89 35.23,94.9 36.6,94.9 | v44.7,92.4 44.7,92.7 44.52,92.88 U2.17 | v46.2,96.4 47,97.2 B2_RNF2.1 | 62.02,84.19 PS1.2 73.4,75.81 73.4,87.71 74.14,88.45 | 62.02,84.19 60.7,85.5 | 60.7,85.5 59.48,86.73 | 59.48,86.73 58.2,88 U3.5 | U3.8 62.02,84.19 | 75.39,89.7 76.67,90.97 76.67,91.08 | 76.67,91.08 77.94,92.34 U4.8 | U4.7 76.67,91.08 | U4.6 75.39,89.7 | 74.14,88.45 75.39,89.7 | U4.5 74.12,88.47 74.14,88.45 | U3.6 59.48,86.73 | U3.7 60.74,85.55 60.7,85.5 | 15.27,101.47 14.3,100.5 v14.3,100 17.5,100 17.88,99.62 | B2_RNF1.1 32.7,99.67 v32.7,99.3 33.5,100.1 36.7,100.1 | B1_CVS1.2 18.56,88.04 v18.5,88.1 16.96,89.64 | v22.1,88.5 18.56,84.96 B1_CVS1.2 | 36.25,90.05 37.96,88.34 B2_CVS1.2 37.96,85.1 41.4,88.54 41.56,88.54 v41.4,88.7
  Top 0.813: 5V_C2.2 47,69.14 67.08,69.14 5V_C1.1 66.62,69.03 71.82,74.23 | 71.82,74.23 PS1.2 | J1.3 23.43,61.28 37.28,61.28 3.3V_C2.2 49.14,52.76 49.29,52.91 3.3V_C1.1 63.97,52.91 PS2.2 | FLAPS_SERVO.1 89.99,108.7 99.1,108.7 | 99.1,108.7 ET_SERVO.1 | 99.1,108.7 112.13,108.7 RT_SERVO.1 | v81.3,80.3 75.23,74.23 71.82,74.23
  Bottom 0.2: 44.2,48.2 v38.8,42.8 34.6,42.8 v30.9,39.1 | 44.2,48.2 59.27,48.2 PS2.2 65.8,51.48 65.8,45.19 66.3,44.69 | v31.32,51.18 34.31,48.2 44.2,48.2 | 66.3,44.69 66.3,43.7 | 66.3,43.7 41.9,19.3 v40.9,19.3 35.2,19.3 | 35.2,19.3 25.8,19.3 23.4,21.7 23.4,22.3 v23.3,22.4 | v29.9,14 35.2,19.3 | 66.3,43.7 66.3,31.8 | 66.3,31.8 v62.9,28.4 | v62.9,28.4 60.7,26.2 v60.7,15.4 | v62.9,28.4 57.2,22.7 v51.6,22.7 | 66.3,31.8 66.3,28.8 77.5,17.6 | 77.5,17.6 77.7,17.4 77.7,17.3 v77.8,17.2 | v95.3,15.5 93.2,17.6 77.5,17.6 | v90.7,27.2 89.9,28 82.98,28 66.3,44.69 | JP1.1 98.62,27.62
  Bottom 0.254: 131.6,91.4 119.9,91.4 v119.8,91.5 | 131.6,91.4 131.8,91.6 v131.9,91.6 | 135.3,91.4 131.6,91.4 | v139.3,91.5 139.2,91.4 135.3,91.4 | v135.5,91.6 135.3,91.4
  Bottom 0.305: v81.8,52.4 84.7,52.4 87.1,50 v90.9,50 94.6,50 99.4,45.2 99.4,42.2 v100.4,41.2 102.2,39.4 v102.3,39.4 | v102.3,39.4 102.3,35.7 | 102.3,35.7 102.3,31.2 | 102.3,31.2 v111.1,22.4 126,7.5 126,7.4 | 102.3,31.2 102.25,31.25 98.62,27.62 | v104.5,33.5 102.3,35.7 | 126,7.4 ENC_RT.1 | ENC_ET.1 135,7.4 126,7.4 | v81.8,52.4 81.8,52.51 76.71,52.51 | 76.71,52.51 64.78,52.51 PS2.2 64.28,53.01 74.28,53.01 93.56,72.3 126.07,72.3 145.97,92.2 PEDALS.5 | v114.4,70.1 110.27,70.1 v106.3,70.1 v102.6,70.1 97.2,70.1 v96.5,69.4 96.4,69.3 93.6,69.3 v84.1,59.8 84,59.8 76.71,52.51 | v81.8,52.4 106.1,52.4 112.6,58.9 119.7,58.9 v120.2,59.4 | v109.9,39.4 109.9,39.6 111.1,40.8 111.1,40.81 111.5,41.21 v111.5,41.41 111.5,44.1 v119.2,51.8 | v102.3,39.4 v104.6,41.7
  Bottom 0.508: v18.5,88.1 14.84,91.76 v14.84,92.95 14.3,93.49 v14.3,100 | v22.1,88.5 25.5,91.9 v25.5,92 25.5,95.3 v26.63,96.43 | v32.7,99.3 32.7,94.8 v34.21,93.29 34.21,93.19 38,89.4 38,84.44 B2_CVS1.2 | v41.4,88.7 44.5,91.8 44.5,92.2 v44.7,92.4 44.7,94.9 v46.2,96.4 | B1_CVS1.2 B1_CVS2.1 | B2_CVS1.2 36.16,84.4 27.16,75.4 22.4,75.4 17.93,70.93 J1.2 | B2_CVS2.1 38.16,84.6 B2_CVS1.2
  Bottom 0.813: J1.2 22.15,72.7 25.44,72.7 29.1,69.04 44.3,69.04 5V_C2.2 | FLAPS_SERVO.1 87.93,86.93 v81.3,80.3
  other vias: 116.4,36.1 79.5,48.6 76.3,48.6 103.9,63.3 100.6,58.2 100.5,51.5 112,51.4 122.9,50.8 122.9,69 123.5,61.5 105.9,72.2 107.1,75.1 94.8,72.2 87.2,74.7 20.4,94.5 22,94.5 20.4,93.2 22,93.2 20.4,96.3 22,96.3 20.4,97.6 22,97.6 39.6,98 41.2,98 39.6,96.7 41.2,96.7 39.6,94.9 41.2,94.9 39.6,93.6 41.2,93.6
  pour Bottom (isolate 0.254): 62.2,53 62.2,63.2 62.1,63.3 70.2,63.3 85.4,78.5 124.9,78.5 125.2,78.2 125.2,35.2 125.1,35.1 62.5,35.1 62.2,35.4
  pour Top (isolate 0.254): 62.2,34.8 62.2,62.1 70.4,62.1 70.5,62 70.5,63.8 85.1,78.4 125.3,78.4 125.3,35.1 62.5,35.1
  pour Bottom: 19.8,98.1 22.6,98.1 22.6,92.7 19.8,92.7
  pour Bottom: 39,98.5 41.8,98.5 41.8,93.1 39,93.1
LED1
  Top 0.2: RLED1_2.1 127.29,87.03 118.33,87.03 109.35,78.05 U$45.46
LED1_1
  Top 0.2: BFS20_LED1.1 130.03,91.49 RLED1_2.2
LED2
  Top 0.2: RLED2_2.1 130.41,86.1 118.7,86.1 109.85,77.25 U$45.45
LED2_1
  Top 0.2: BFS1_LED2.1 133.81,91.22 RLED2_2.2
LED3
  Top 0.2: RLED3_2.1 133.16,85.1 119,85.1 110.35,76.45 U$45.44
LED3_1
  Top 0.2: BFS2_LED3.1 137.59,93.19 137.59,91.25 RLED3_2.2
N$1
  Top 0.2: IC4.5 92.81,22.18 100.3,14.7 R4.2 100.3,4.3 XC3.1
N$2
  Top 0.2: IC4.4 92.98,20.91 99.5,14.4 99.5,11.08 R3.2 99.4,10.74 99.4,5.13 XC3.2
N$3
  Top 0.2: IC4.3 91.6,19.6 92.7,19.6 93.3,19 93.3,14 90.96,11.66 90.96,10.84 R2.2 90.9,10.42 90.9,6.08 XC3.3
N$4
  Top 0.2: IC4.2 90.58,18.38 89.8,17.6 89.8,8.98 R1.2 89.91,8.45 XC3.4
N$5
  Top 0.2: IC4.10 82.62,24.73 70.2,12.3 70.2,8.72 R5.2 70.28,4.32 XC4.3
N$6
  Top 0.2: IC4.11 85.31,23.55 82.77,23.55 71.16,11.94 71.16,10.84 R6.2 71.1,10.38 71.1,5.19 XC4.2
N$7
  Top 0.2: IC4.12 82.78,22.18 79.46,18.86 79.46,11.16 R7.2 80,10.62 80,6.42 XC4.1
N$8
  Top 0.2: IC4.14 83.25,19.64 81.48,17.88 81.48,9.26 R8.2 86.1,3.44 XC3.5
N$10
  Top 0.508: U4.16 69.05,102.33 67.13,104.24 U_STEP_RT.1
N$11
  Top 0.508: U_STEP_RT.4 72.85,100.94 U4.13
N$12
  Top 0.508: U_STEP_RT.3 71.59,103.47 U4.14
N$13
  Top 0.2: IC1.2 59.44,18.48 51.8,10.84 R9.2 51.8,10.44 51.4,10.04 51.4,4.22 XC6.1
N$14
  Top 0.2: XC6.2 50.47,5.18 R10.2 50.5,8.57 50.5,11.5 58.76,19.75 IC1.3
N$15
  Top 0.2: R11.2 61.6,8.61 XC4.5 61.6,13.6 63,15 63,19.5 61.48,21.02 IC1.4
N$16
  Top 0.2: IC1.5 61.6,22.3 64,19.9 64,14.69 62.47,13.16 R12.2 62.47,5.96 62.51,5.92 62.75,5.92 XC4.4
N$17
  Top 0.2: SWITCHES2.1 30.35,3.26 35.28,8.19 R13.2 35.28,11.58 48.53,24.84 IC1.10
N$18
  Top 0.2: XC6.5 37.12,6.28 36.1,7.3 36.12,7.32 36.12,10.36 R14.2 36.26,10.86 48.97,23.57 IC1.11
N$19
  Top 0.2: IC1.12 52.49,22.3 44.4,14.2 44.2,14 43.96,13.76 R15.2 44.19,10.17 44.19,6.51 XC6.4
N$20
  Top 0.2: IC1.14 52.58,19.75 45.04,12.21 R16.2 | XC6.3 45.04,3.56 R16.2 | R16.2
N$21
  Top 0.508: U4.15 70.31,104.86 70.94,105.49 U_STEP_RT.2
N$22
  Top 0.508: U3.16 53.12,98.95 46.34,105.74 U_STEP_ET.1
N$23
  Top 0.508: U3.15 54.4,100 50.15,104.24 U_STEP_ET.2
N$24
  Top 0.2: SWITCHES2.4 16.42,8.95 R18.2 19.61,12.7 27.5,12.7 29.8,15 29.8,15.1 30.09,15.38 IC2.3
N$25
  Top 0.2: IC2.4 31.36,14.26 28.06,10.96 28.06,9.76 27.35,9.05 R19.2 27.15,8.38 22.03,3.26 SWITCHES2.3
N$26
  Top 0.2: IC2.5 32.62,14.07 R20.2 28.95,8.17 SWITCHES2.2
N$27
  Top 0.2: IC2.2 28.82,15.01 27.11,13.3 22.19,13.3 R17.2 18.8,13.6 16.2,11 SWITCHES1.1
N$28
  Top 0.2: R24.2 21.84,18.76 22.04,18.76 | 22.04,18.76 18.08,14.81 SWITCHES1.2 | IC2.14 30.09,24.02 29.4,24.7 28.4,24.7 22.46,18.76 22.04,18.76
N$29
  Top 0.2: IC2.12 32.62,23.88 31.13,25.37 28.14,25.37 22.46,19.7 19.99,19.7 R23.2 19.59,19.6 18.61,18.62 SWITCHES1.3
N$30
  Top 0.2: IC2.11 33.8,22.19 33.8,23.5 31,26.3 R22.2 16.02,22.43 SWITCHES1.4
N$31
  Top 0.2: IC2.10 35.16,23.14 30.92,27.38 22.09,27.38 R21.2 21.69,27.38 14.38,27.38 SWITCHES1.5
N$32
  Top 0.508: U3.14 55.66,102.53 53.96,104.24 U_STEP_ET.3
N$33
  Top 0.508: U3.13 56.94,105.81 U_STEP_ET.4
N$34
  Top 0.406: U2.10 36.41,94.17
  Top 0.508: B2_CT.2 B2_RT.2 36.41,94.17
N$35
  Top 0.406: U2.4 34.55,98.08 B2_RNF1.2 35.13,98.33 35.52,98.72 U2.3
N$36
  Top 0.2: IC3.5 32.75,38.32 30.73,36.3 R28.2 29.29,36.3 26.14,33.15 15.94,33.15 13.24,30.45 SWITCHES1.6
N$37
  Top 0.2: IC3.4 31.68,41.65 31.68,38.25 30.63,37.19 28.59,37.19 27.68,36.28 R27.2 25.47,34.36 13.74,34.36 SWITCHES1.7
N$38
  Top 0.2: IC3.3 30.21,40.41 28.72,38.92 20.52,38.92 R26.2 19.28,37.67 SWITCHES1.8
N$39
  Top 0.2: IC3.2 28.9,41.8 28.9,40.6 27.98,39.68 22.77,39.68 R25.2 22.63,39.7 15.02,39.7 SWITCHES1.9
N$40
  Top 0.2: IC3.14 30.3,48.08 30.3,49.3 30,49.6 26.01,49.6 24.11,47.7 R32.2 20.2,45.29 SWITCHES1.10
N$41
  Top 0.2: IC3.12 32.8,48.04 32.8,49.4 31.85,50.35 25.25,50.35 23.4,48.5 20.53,48.5 R31.2 13.72,48.62 SWITCHES1.11
N$42
  Top 0.2: IC3.11 34.02,49.58 31.3,52.3 29.3,52.3 28.44,53.16 R30.2 | R30.2 13.49,53.16 SWITCHES1.12 | R30.2
N$44
  Top 0.406: U2.25 43.77,98.08 44.6,98.9 44.8,98.9 | U2.26 43.92,98.72
  Top 0.508: 43.92,98.72 44.8,99.6 | 44.8,98.9 44.8,99.6 | B2_RNF2.2 45.87,100.67 44.8,99.6
N$48
  Top 0.2: IC3.10 35.31,48.01 35.31,49.51 31.68,53.14 R29.2 28.51,54.52 17.44,54.52 15.24,56.72 SWITCHES1.13
N$54
  Top 0.2: CG_106.2 93.4,47.19 U$45.106
N$55
  Top 0.2: RLED2_1.1 134.79,95.72 BFS1_LED2.3
N$62  (via drill 0.5)
  other vias: 79.8,39.8
N$63  (via drill 0.5)
  other vias: 64.7,38.4
N$64  (via drill 0.5)
  Top 0.2: IC2.13 31.1,22.35 v31.1,24 | v26.5,40.5 26.5,40.67 IC3.1
  Bottom 0.2: v31.1,24 26.5,28.6 v26.5,40.5
N$65  (via drill 0.5)
  Top 0.2: IC1.13 52.73,21.02 49.2,17.5 v49,17.5 | IC2.1 27.55,15.14 v26.7,14.3
  Bottom 0.2: v49,17.5 44.75,13.25 27.75,13.25 v26.7,14.3
N$66  (via drill 0.5)
  Top 0.2: IC4.13 85.29,20.8 83,20.8 80.7,18.5 80.7,16.8 v80.5,16.6 | v61.85,16.35 60.98,17.21 IC1.1
  Bottom 0.2: v80.5,16.6 80,16.1 62.1,16.1 v61.85,16.35
N$77
  Top 0.406: U1.3 17.2,98.33 | 17.2,98.33 16,98.33 B1_RNF1.2 | U1.4 17.85,97.67 17.2,98.33
N$78
  Top 0.508: B1_CT.2 B1_RT.2 14.56,91.36 16.98,93.78 U1.10
N$79
  Top 0.406: U1.25 24.5,97.67 25.15,98.33 U1.26
  Top 0.508: 25.15,98.33 25.85,98.33 B1_RNF2.2
N$97
  Top 0.2: USB.VBUS 108.56,27.55 RVBUS_1.2
N$103
  Top 0.2: RLED1_1.1 BFS20_LED1.3
N$104
  Top 0.2: LEDS.2 131.19,99.52 RLED1_1.2
N$105
  Top 0.2: LEDS.3 135,99.55 RLED2_1.2
N$106
  Top 0.2: RLED3_1.1 BFS2_LED3.3
N$107
  Top 0.2: LEDS.4 138.81,99.49 RLED3_1.2
NRST  (via drill 0.5)
  Top 0.2: JP1.2 98.6,30.76 105.84,38 108.5,38 v108.7,38.2 | v109,49.4 109,53.9 113.3,58.2 U$45.25
  Bottom 0.2: v108.7,38.2 109,38.5 v109,49.4
PE  (via drill 0.5)
  Top 0.203: IC4.15 85.43,18.4 86.8,18.4 87.75,19.35 87.75,35.65 88.5,36.4 88.5,39.1 v88.6,39.2 | IC3.15 28.95,46.85 30.4,45.4 v63.6,45.4 v77.1,45.4 84.1,45.4 88,41.5 89.3,41.5 | U$45.111 97.3,44.29 97.3,42.97 95.83,41.5 89.3,41.5 | IC2.15 28.9,22.01 28.9,21 30,19.9 38.2,19.9 v61.4,43.1 | v89.25,41.45 89.3,41.5 | IC1.15 54.12,18.6 55.4,18.6 57.3,20.5 57.3,25.7 73.1,41.5 73.1,41.6 v73.2,41.7
  Bottom 0.203: v61.4,43.1 61.4,43.2 v63.6,45.4 | v88.6,39.2 88.6,40.8 v89.25,41.45 | v77.1,45.4 76.9,45.4 v73.2,41.7
ROT1_A
  Top 0.2: R36.1 118.16,44.44 116.41,46.19 U$45.1
  Top 0.254: ENC_RT.3 118.16,3.32 R36.1
ROT1_B
  Top 0.2: R35.1 119.06,44.54 116.91,46.69 U$45.2
  Top 0.254: ENC_RT.2 119.36,5.93 119.36,10.7 R35.1
ROT2_A
  Top 0.2: ENC_ET.3 131.58,9.18 R34.1 131.46,9.3 131.46,13.13 120.07,24.52 120.07,44.73 117.6,47.2 U$45.3
ROT2_B
  Top 0.2: ENC_ET.2 135.39,8.31 132.6,11.1 R33.1 132.36,13.63 121.07,24.92 121.07,44.83 118.2,47.7 U$45.4
SERVO1  (via drill 0.5)
  Top 0.2: v93.9,75.4 97.35,71.95 U$45.70
  Bottom 0.2: FLAPS_SERVO.2 91.74,77.46 93.8,75.4 v93.9,75.4
SERVO2  (via drill 0.5)
  Top 0.2: v97.05,75.8 97.05,74.8 97.8,74.05 97.8,65.59 U$45.69
  Bottom 0.2: ET_SERVO.2 97.07,98.74 97.07,75.82 v97.05,75.8
SERVO3  (via drill 0.5)
  Top 0.2: U$45.34 115.75,62.74 117.52,62.74 118.4,63.62 v118.4,74.6
  Bottom 0.2: RT_SERVO.2 118.4,106.24 v118.4,74.6
SWCH_CLK
  Top 0.2: IC3.7 35.3,42.7 36.5,43.9 63.4,43.9 | IC4.7 90.08,24.73 89.6,25.2 89.6,39.19 90.61,40.2 | IC1.7 61.23,24.84 80.3,43.9 82.3,43.9 86,40.2 90.61,40.2 | 98.15,42.46 95.89,40.2 90.61,40.2
  Top 0.203: IC2.7 35.16,16.96 35.8,17.6 37.1,17.6 63.4,43.9 80.3,43.9 | U$45.113 98.35,42.66 98.15,42.46
SWCH_CS1  (via drill 0.5)
  Top 0.2: v88.7,33.5 88.7,32.9 89,32.6 89,24.35 89.89,23.45 IC4.6 | 99.85,42.16 96.34,38.65 93.55,38.65 v92.6,37.7
  Top 0.203: 99.85,42.16 U$45.116
  Bottom 0.2: v88.7,33.5 88.7,33.8 v92.6,37.7
SWCH_CS2  (via drill 0.5)
  Top 0.2: 99.1,42.08 96.22,39.2 92.4,39.2 v90.8,37.6
  Top 0.203: 99.1,42.08 99.35,42.33 U$45.115 | IC1.6 62.06,23.57 76.1,37.6 v85.4,37.6
  Bottom 0.2: v90.8,37.6 86.33,37.6
  Bottom 0.203: 86.33,37.6 v85.4,37.6
SWCH_CS3  (via drill 0.5)
  Top 0.2: 33.89,17.5 34.9,18.5 v35.7,18.5 | v65.3,41.4 66.9,43 v77.8,43 | 98.6,42.24 96.06,39.7 91.17,39.7 v90.68,39.22
  Top 0.203: 33.89,17.5 IC2.6 | 98.6,42.24 98.85,42.49 U$45.114
  Bottom 0.2: v35.7,18.5 42,18.5 64.9,41.4 v65.3,41.4 | v90.68,39.22 89.77,38.3 86.7,38.3 82,43 v77.8,43
SWCH_CS4
  Top 0.2: 97.65,42.62 95.73,40.7 86.87,40.7 82.97,44.6 34.89,44.6 34.02,43.73 IC3.6
  Top 0.203: 97.65,42.62 97.85,42.82 U$45.112
SWCH_SER
  Top 0.2: U$45.110 96.85,43.1 96.05,42.3 88.94,42.3 88.67,42.57 84.94,46.3 73.3,46.3 62.75,46.3 32,46.3 31.48,46.81 IC3.13
SWCLK  (via drill 0.5)
  Top 0.2: U$45.109 96.35,44.05 v95.5,43.2
  Bottom 0.2: JP1.3 95.5,35.8 v95.5,43.2
SWDIO  (via drill 0.5)
  Top 0.2: U$45.105 95.5,47.69 v96.29,46.9 v96.3,46.9 | v96.3,46.9
  Bottom 0.2: JP1.4 98.6,35.94 96.4,38.14 96.4,46.8 v96.3,46.9
U1_1  (via drill 0.5)
  Top 0.2: U3.1 53.12,89.83 v53.1,89.8 | U$45.76 92.7,62.19 87.35,67.54 v84.4,67.54 v84.4,67.55
  Bottom 0.2: v53.1,89.8 53.3,89.6 53.3,84.9 70.65,67.55 v84.4,67.55
U1_2  (via drill 0.5)
  Top 0.2: U3.2 v54.4,89.81 v54.4,89.8 | U$45.75 93,62.69 87.2,68.49 v85.4,68.49 v85.4,68.5
  Bottom 0.2: v54.4,89.8 54.4,84.8 70.7,68.5 v85.4,68.5
U1_3  (via drill 0.5)
  Top 0.2: U3.3 55.66,89.86 v55.6,89.8 | U$45.74 93.3,63.19 87.04,69.45 v86.3,69.45
  Bottom 0.2: v55.6,89.8 55.6,84.5 70.65,69.45 v86.3,69.45
U1_4  (via drill 0.5)
  Top 0.2: U3.4 56.9,93.25 v56.9,89.8 | v87.2,70.3 87.2,70.19 93.7,63.69 U$45.73
  Bottom 0.2: v56.9,89.8 56.9,84.1 70.7,70.3 v87.2,70.3
U2_1
  Top 0.2: U4.1 69.05,93.9 71.84,96.7 82.2,96.7 99.85,79.05 U$45.65
U2_2
  Top 0.2: U4.2 70.31,94.22 72.2,96.1 81.9,96.1 99.3,78.7 99.3,66.1 99.3,65.99 99.3,65.59 U$45.66
U2_3
  Top 0.2: U4.3 71.59,94.08 73,95.5 81.6,95.5 98.85,78.25 U$45.67
U2_4
  Top 0.2: U4.4 72.85,94.16 73.6,94.9 81.4,94.9 98.35,77.95 U$45.68
VBUS  (via drill 0.5)
  Top 0.2: RVBUS_1.1 107.51,32.25 RVBUS_2.2 107.61,34 v107.8,34 | v105,47.7 103.01,49.69 U$45.101
  Bottom 0.2: v107.8,34 107.8,44.8 105,47.6 v105,47.7
VCAP
  Top 0.254: U$45.71 96.83,65.56 96.83,66.47 95.06,68.24 C_VCAP.2

## Text on the board
tNames: GND